# Altium schematic sheet Xpt2046.SchDoc
size A; SheetNumber: 2; SheetTotal: 12
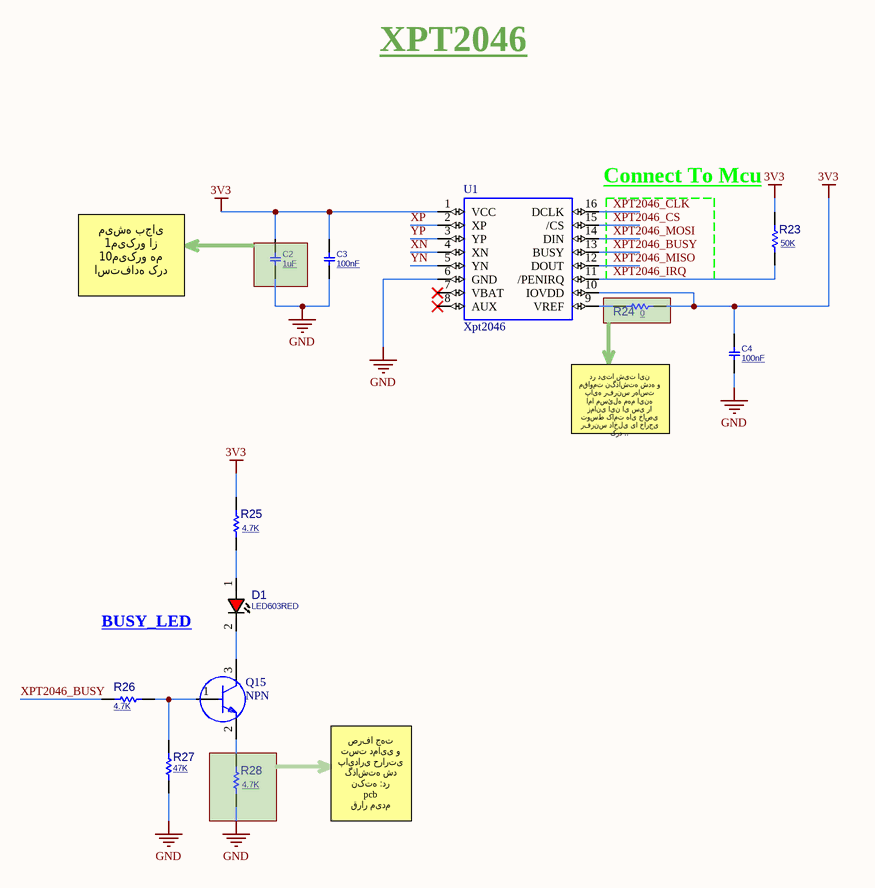
[diagram p0: Xpt2046.SchDoc]

## Parts
C2  1uF  [C1206]
C3  100nF  [C0603]
C4  100nF  [C0603]
D1  LED603RED  [LED0603RED]
Q15  NPN  [FP-SOT23-IPC_A]
R23  50K  [R0603]
R24  0  [R0603]
R25  4.7K  [R0603]
R26  4.7K  [R0603]
R27  47K  [R0603]
R28  4.7K  [R0603]
U1  Xpt2046  [Xpt2046]

## Nets
3V3: C2.2 C3.2 C4.2 R23.2 R24.1 R25.2 U1.1(VCC) U1.10(IOVDD)
GND: C2.1 C3.1 C4.1 R27.2 R28.1 U1.6(GND)
XN: U1.4(XN)
XP: U1.2(XP)
XPT2046_BUSY: R26.2 U1.13(BUSY)
XPT2046_CLK: U1.16(DCLK)
XPT2046_CS: U1.15(/CS)
XPT2046_IRQ: R23.1 U1.11(/PENIRQ)
XPT2046_MISO: U1.12(DOUT)
XPT2046_MOSI: U1.14(DIN)
YN: U1.5(YN)
YP: U1.3(YP)
NetD1_1: D1.1(ANODE) R25.1
NetD1_2: D1.2(CATHODE) Q15.3(C)
NetQ15_1: Q15.1(B) R26.1 R27.1
NetQ15_2: Q15.2(E) R28.2
NetR24_2: R24.2 U1.9(VREF)

Not connected (* = marked no-connect by the designer): U1 7(VBAT)* 8(AUX)*

## Notes on the sheet
- XPT2046
- Connect To Mcu
- میشه بجای 1میکرو از 10میکرو هم استفاده کرد
- در دیتا شیت این مقاومت نگذاشته شده و پایه رفرنس رهاست
  اما مسئله مهم اینه زمانی این ای سی را توسط کامت های خاصی رفرنس داخلی یا خارجی کرد ..
- BUSY_LED
- صرفا جهت تست دمایی و پایداری حرارتی گذاشته شد نکته :در
  pcb
  قرار میدم

## Library data of the parts
C2 = CAP_SMD_MLCC_1206: CAP, MLCC, -F, -V, MATERIAL, -%, 0201; PARAM: -, -%; MANF_P#: MANF_PART#; PRICE: 100= 1$; MANF: -; PARAM2: -V; ASSEMBLY: ASSEMBLY; VALUE: 1uF
C3 C4 = CAP_SMD_MLCC_0603: CAP, MLCC, -F, -V, MATERIAL, -%, 0201; PARAM: -, -%; MANF_P#: MANF_PART#; PRICE: 100= 1$; MANF: -; PARAM2: -V; ASSEMBLY: ASSEMBLY; VALUE: 100nF
D1 = LED_SMD_0603_RED: LED, SMD, 0603, RED; PARAM: 30mA, 640nm; DESC: DESCRIPTION; MANF_P#: MANF_PART#; PARAM2: 1.8~2.5V; MANF: MANF; ASSEMBLY: ASSEMBLY; PRICE: PRICE; VALUE: LED603RED
Q15 = CMP-2000-04931-2: Frequency: 300MHz; Collector Emitter Voltage (VCEO): 40V; Power Dissipation: 350mW; Element Configuration: Single; Max Power Dissipation: 300mW; Max Collector Current: 200mA; Collector Emitter Saturation Voltage: 300mV; Number of Elements: 1; hFE Min: 100; Collector Base Voltage (VCBO): 60V; Emitter Base Voltage (VEBO): 6V; Contact Plating: Tin; Package Quantity: 3000; Max Frequency: 300MHz; REACH SVHC: No SVHC; Max Operating Temperature: 150°C; Width: 1.4mm; Voltage Rating (DC): 40V; Radiation Hardening: No; Case/Package: SOT-23; Height: 1mm; Collector Emitter Breakdown Voltage: 40V; Length: 3.05mm; Polarity: NPN; Packaging: Tape and Reel; Number of Pins: 3; Min Operating Temperature: -55°C; Gain Bandwidth Product: 300MHz; Mount: Surface Mount; Weight: 0.000282oz; Continuous Collector Current: 200mA; Transition Frequency: 300MHz; Max Breakdown Voltage: 40V; Lead Free: Lead Free
R23-R28 = RES_SMD: RESISTOR, SMD; PARAM: -W; DESC: DESCRIPTION; DIST#: MOUSER; PARAM2: 1%; MANF_P#: -; MANF: -; ASSEMBLY: ASSEMBLY; PRICE: 100= 0.5$
  R23: VALUE: 50K
  R24: VALUE: 0
  R25 R26 R28: VALUE: 4.7K
  R27: VALUE: 47K